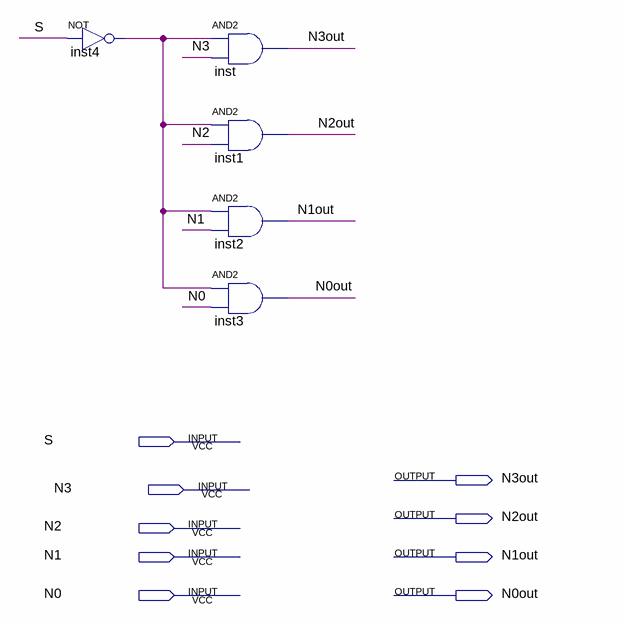
[diagram p0: schematic sheet]
// Quartus schematic ANDpro.bdf as structural Verilog: 5 symbols, 9 pins
module ANDpro (
  input  S,
  input  N3,
  input  N2,
  input  N1,
  input  N0,
  output N3out,
  output N2out,
  output N1out,
  output N0out
);

  wire inst4_out;

  not inst4 (inst4_out, S);
  and inst (N3out, inst4_out, N3);
  and inst1 (N2out, inst4_out, N2);
  and inst2 (N1out, inst4_out, N1);
  and inst3 (N0out, inst4_out, N0);
endmodule
